# EasyEDA Pro project Edge_Nexus_Main_Shield_Source.epro

# Board newShield_2
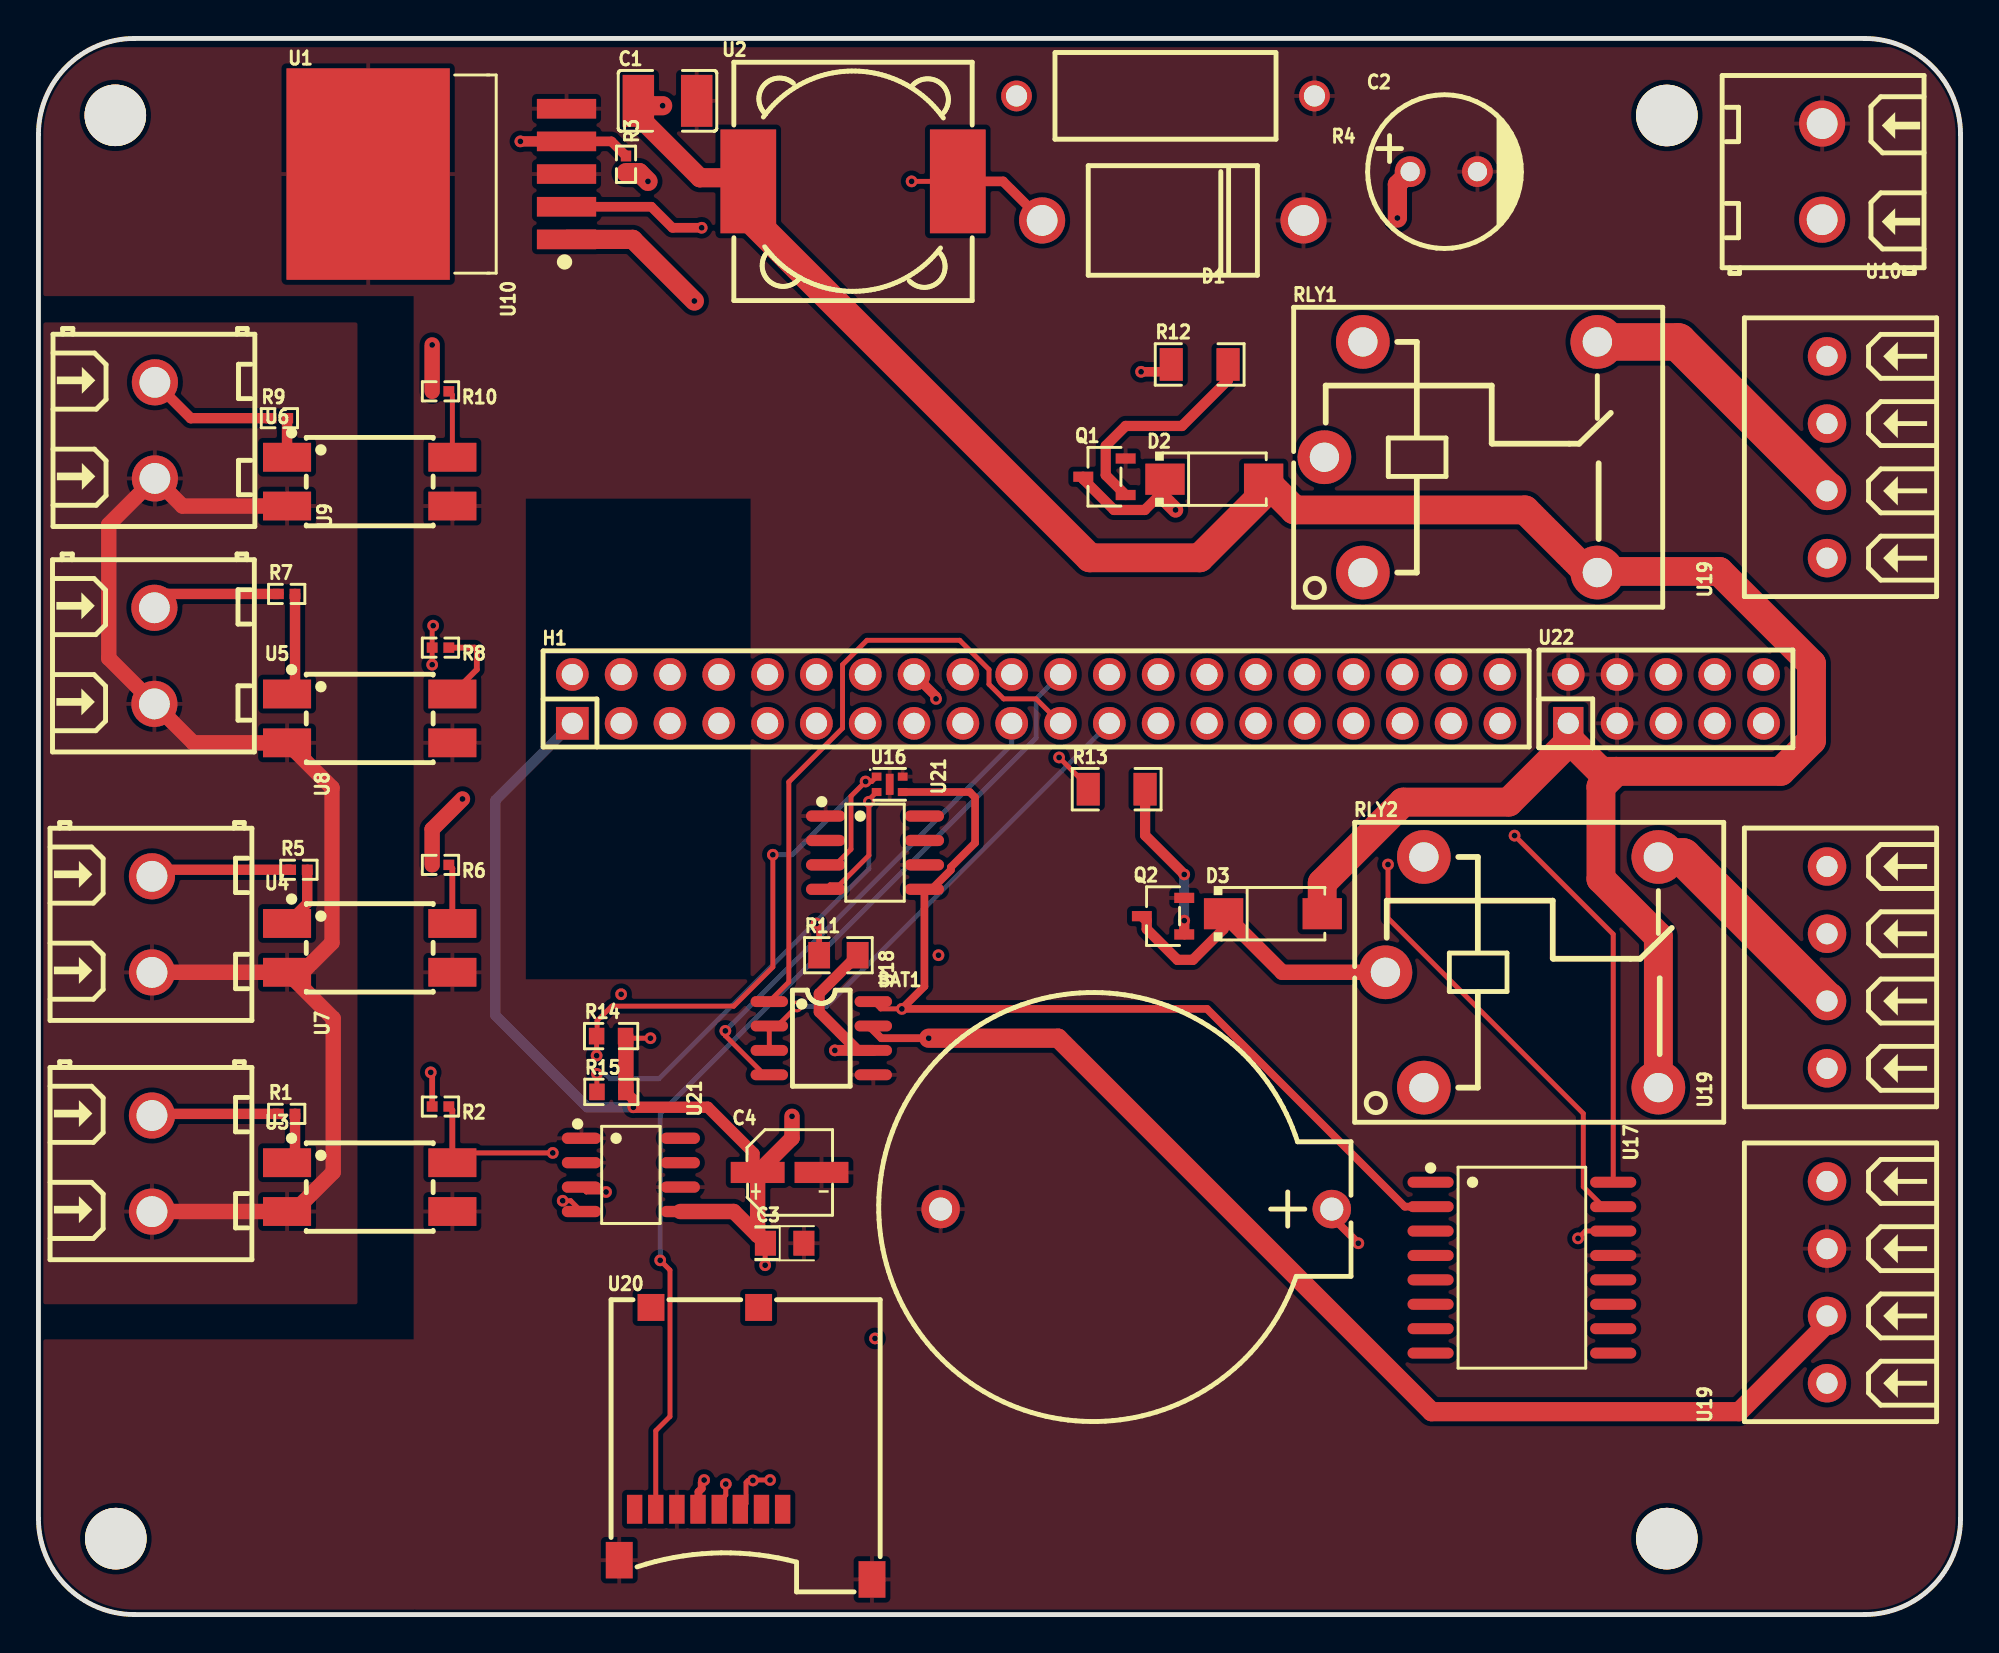
[diagram p0: board, top side]
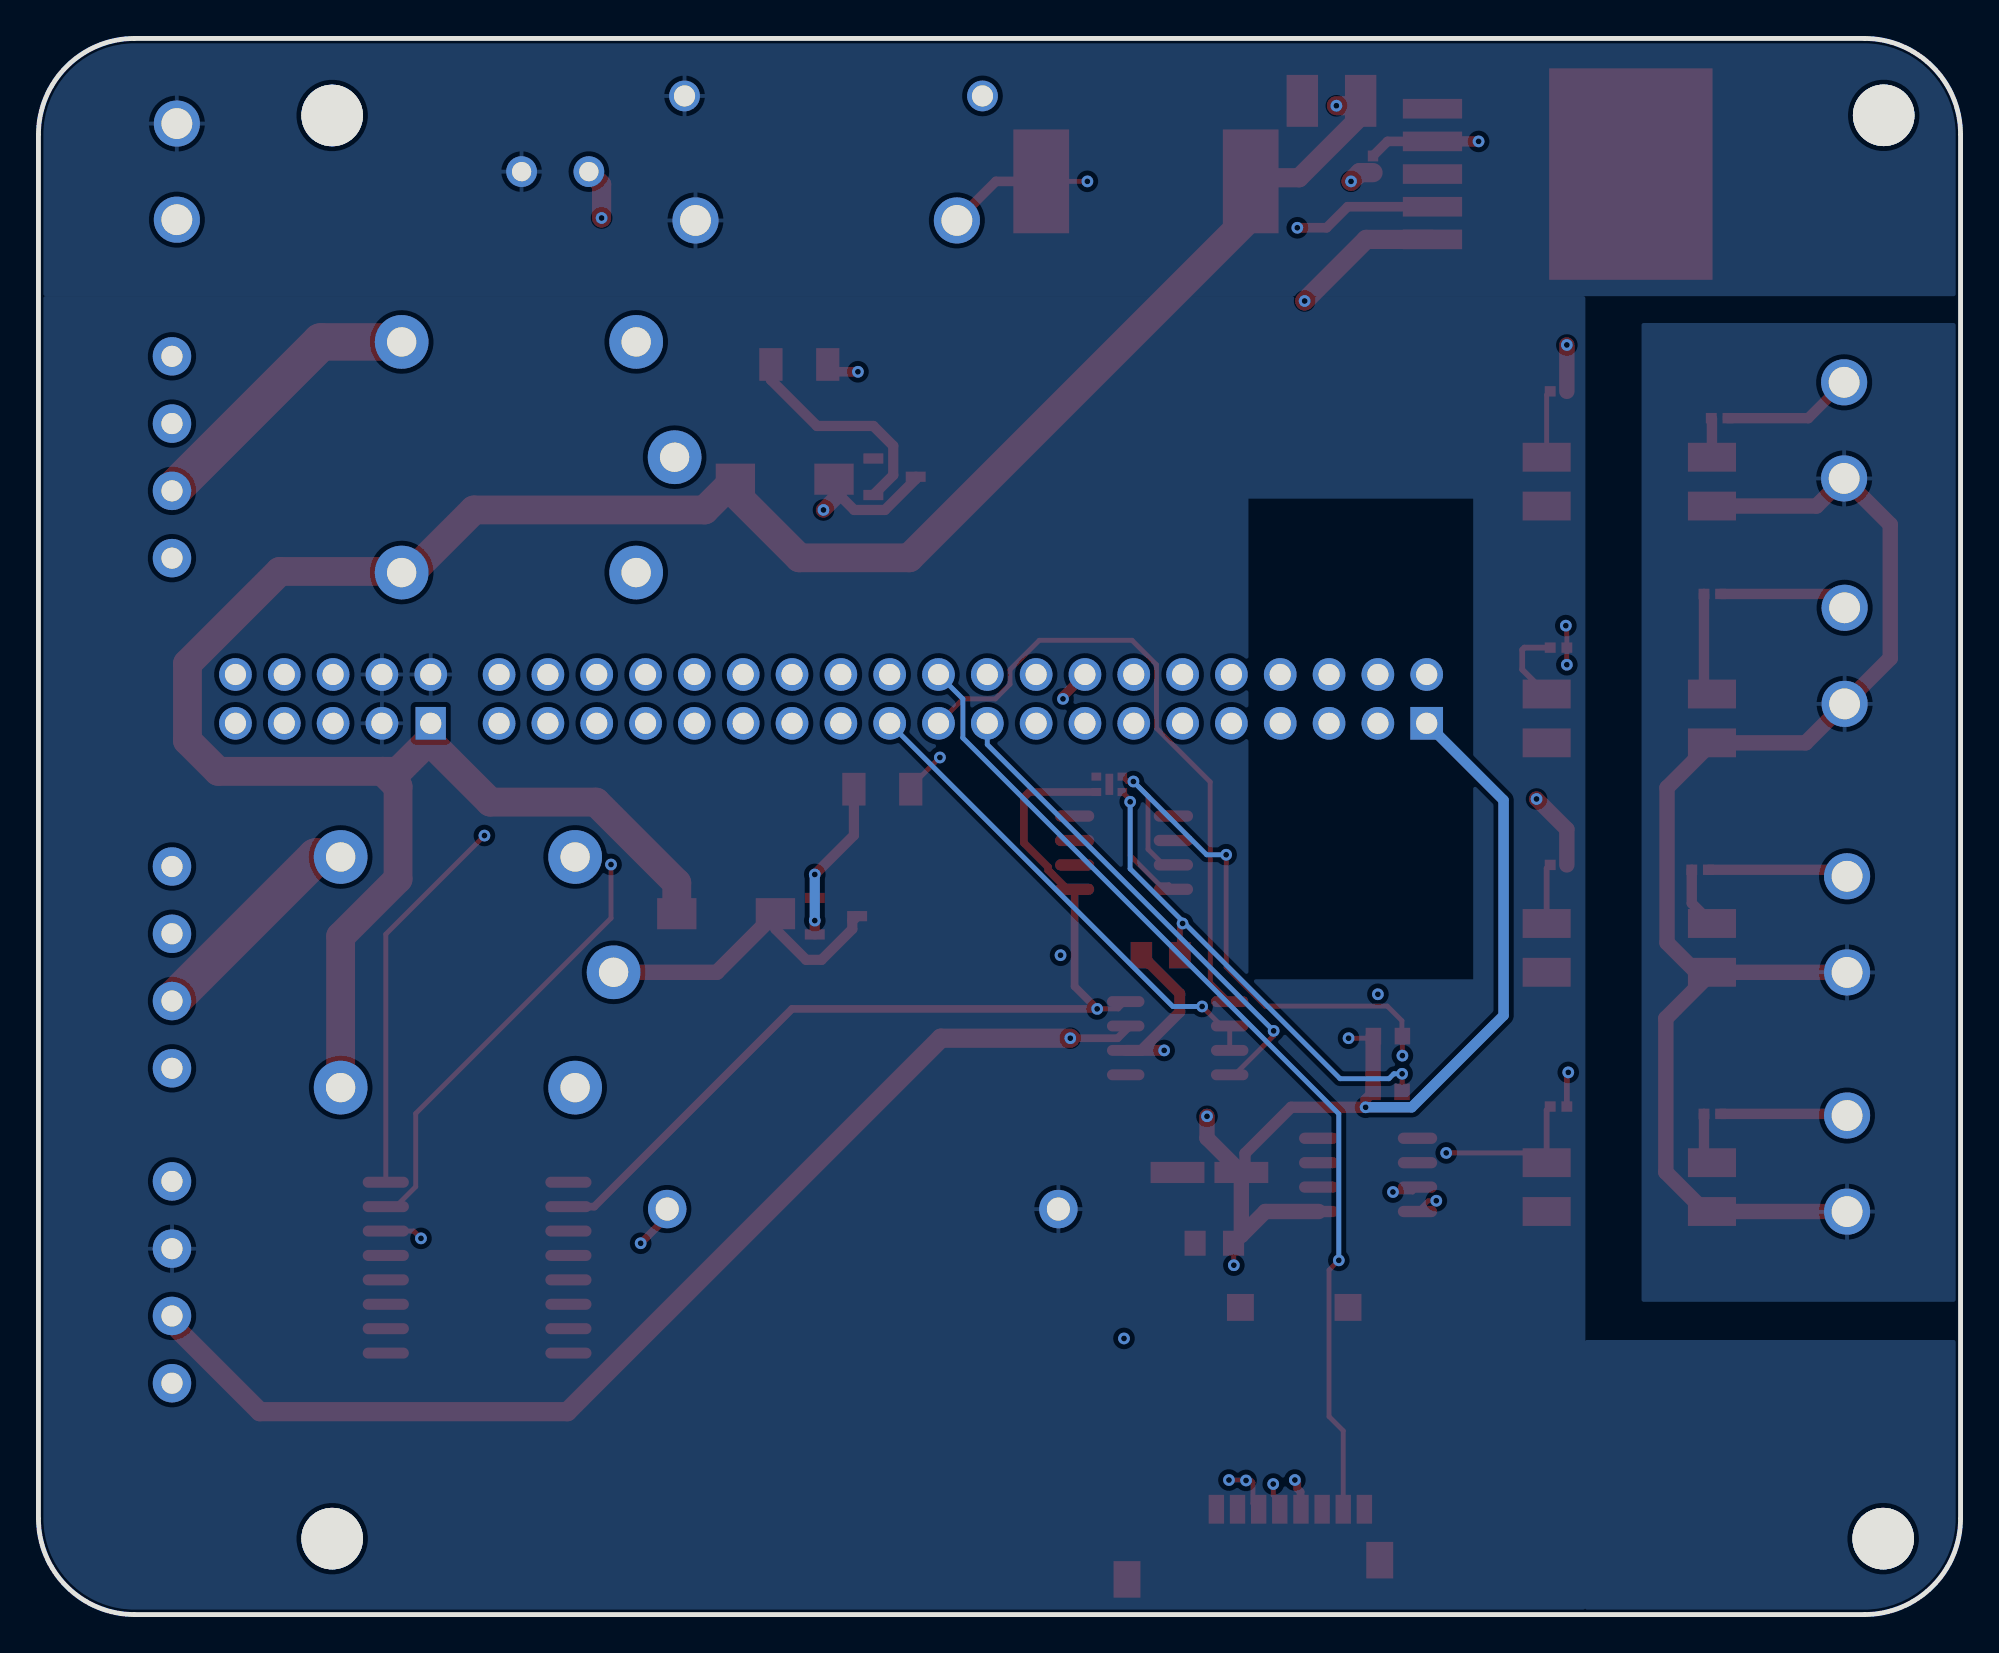
[diagram p1: board, bottom side, seen from below]

Outline 100 x 82 mm; copper layers: Top Layer, Inner1, Inner2, Bottom Layer. Coordinates in mm from the lower left corner of the outline.
Outline path: 0,77 0,5 arc(1.46,1.46) 5,0 95,0 arc(98.54,1.46) 100,5 100,77 arc(98.54,80.54) 95,82 5,82 arc(1.46,80.54) 0,77
Stack: Top Layer 0.035mm Outer layer thickness 1oz / Dielectric1 0.2104mm 7628 RC49% 8.6mil / Inner1 0.0152mm Inner layer thickness / Dielectric2 1.065mm 1.1mm H/HOZ Copper / Inner2 0.0152mm Inner layer thickness / Dielectric3 0.2104mm 7628 RC49% 8.6mil / Bottom Layer 0.035mm Outer layer thickness 1oz

## Design rules (mm)
net 5V_CLEAN: POWER
net GPIO22: SIGNAL
net 3V3_VCC: POWER
net GPIO27: SIGNAL
net GPIO17: SIGNAL
net GPIO4: SIGNAL
net VIN: POWER
net GPIO43: SIGNAL
net RST: SIGNAL
net GPIO44: SIGNAL
net GPIO1: SIGNAL
net GPIO5: SIGNAL
net GPIO2: SIGNAL
net GPIO6: SIGNAL
net GPIO42: SIGNAL
net GPIO7: SIGNAL
net GPIO41: SIGNAL
net RELAY1_CTL: POWER
net RELAY2_CTL: POWER
net GPIO16: SIGNAL
net GPIO39: SIGNAL
net SP3485_TX: SIGNAL
net HMI_LED_DATA: SIGNAL
net SP3485_RX: SIGNAL
net SPI_MISO: SIGNAL
net SP3485_DE_RE: SIGNAL
net SPI_CLK: SIGNAL
net GPIO3: SIGNAL
net SPI_MOSI: SIGNAL
net GPIO46: SIGNAL
net HMI_BTN: SIGNAL
net GPIO9: SIGNAL
net GPIO45: SIGNAL
net GPIO10: SIGNAL
net GPIO48: SIGNAL
net I2C_SDA: SIGNAL
net GPIO47: SIGNAL
net I2C_SCL: SIGNAL
net GPIO21: SIGNAL
net GPIO13: SIGNAL
net GPIO20: SIGNAL
net GPIO14: SIGNAL
net GPIO19: SIGNAL
net VBAT: POWER
net $1N7377: RELAY_HV
net $1N7383: RELAY_HV
net SD_CS: SIGNAL
net COM1: RELAY_HV
net NO1: RELAY_HV
net NC1: RELAY_HV
net NC2: RELAY_HV
net COM2: RELAY_HV
net NO2: RELAY_HV
template: Custom Config
spacing copperThickness1oz (default): track to track 0.102, other pairs 0.152 to 0.3
spacing copperThickness2oz: track to track 0.203, other pairs 0.152 to 0.3
spacing POWER: track to track 0.8, other pairs 0.152 to 0.3
spacing RELAY_HV: track to track 0.152, other pairs 0.152 to 0.3
spacing SIGNAL: track to track 0.152, other pairs 0.152 to 0.3
track width copperThickness1oz: min 0.127, default 0.254, max 2.54
track width copperThickness2oz: min 0.203, default 0.254, max 2.54
track width POWER (default): min 0.127, default 0.254, max 2.54
track width RELAY_HV: min 0.127, default 0.254, max 2.54
track width SIGNAL: min 0.254, default 0.254, max 0.254
differential pair differentialPair (default): width min 0.127, default 0.254, max 2.54; gap min 0.152, default 0.152
via viaSize (default): diameter min 0.5, default 0.61, max 10; hole min 0.3, default 0.305, max 6.3
net class POWER uses POWER
net class SIGNAL uses SIGNAL
net class RELAY_HV uses RELAY_HV
net 5V_CLEAN uses POWER
net GPIO22 uses SIGNAL
net 3V3_VCC uses POWER
net GPIO27 uses SIGNAL
net GPIO17 uses SIGNAL
net GPIO4 uses SIGNAL
net VIN uses POWER
net GPIO43 uses SIGNAL
net RST uses SIGNAL
net GPIO44 uses SIGNAL
net GPIO1 uses SIGNAL
net GPIO5 uses SIGNAL
net GPIO2 uses SIGNAL
net GPIO6 uses SIGNAL
net GPIO42 uses SIGNAL
net GPIO7 uses SIGNAL
net GPIO41 uses SIGNAL
net RELAY1_CTL uses POWER
net RELAY2_CTL uses POWER
net GPIO16 uses SIGNAL
net GPIO39 uses SIGNAL
net SP3485_TX uses SIGNAL
net HMI_LED_DATA uses SIGNAL
net SP3485_RX uses SIGNAL
net SPI_MISO uses SIGNAL
net SP3485_DE_RE uses SIGNAL
net SPI_CLK uses SIGNAL
net GPIO3 uses SIGNAL
net SPI_MOSI uses SIGNAL
net GPIO46 uses SIGNAL
net HMI_BTN uses SIGNAL
net GPIO9 uses SIGNAL
net GPIO45 uses SIGNAL
net GPIO10 uses SIGNAL
net GPIO48 uses SIGNAL
net I2C_SDA uses SIGNAL
net GPIO47 uses SIGNAL
net I2C_SCL uses SIGNAL
net GPIO21 uses SIGNAL
net GPIO13 uses SIGNAL
net GPIO20 uses SIGNAL
net GPIO14 uses SIGNAL
net GPIO19 uses SIGNAL
net VBAT uses POWER
net $1N7377 uses RELAY_HV
net $1N7383 uses RELAY_HV
net SD_CS uses SIGNAL
net COM1 uses RELAY_HV
net NO1 uses RELAY_HV
net NC1 uses RELAY_HV
net NC2 uses RELAY_HV
net COM2 uses RELAY_HV
net NO2 uses RELAY_HV

## Placement (name value [footprint] x y rotation side)
BAT1  CR2032-2-1  [BAT-TH_CR2032-2-1]  57.11 21.1 0 top
C1  220uF  [C1210]  32.73 78.75 0 top
C2  100uF  [CAP-TH_BD8.0-P3.50-D0.6-FD-H10.0]  73.11 75.07 0 top
C3  10uF  [CAP-SMD_L2.0-W1.3-FD]  38.82 19.32 0 top
C4  100nF  [CAP-SMD_BD4.0-L4.3-W4.3-FD]  39.08 23 0 top
D1  1N5822  [DO-201AD_BD5.3-L8.4-P12.50-D1.4-RD]  59.02 72.53 180 top
D2  -  [SMA_L4.4-W2.8-LS5.4-RD]  61.18 59.07 0 top
D3  -  [SMA_L4.4-W2.8-LS5.4-RD]  64.22 36.46 0 top
H1  2.54-2*20P母长PC104  [HDR-TH_40P-P2.54-V-F-R2-C20-S2.54-2]  51.91 47.64 0 top
NOREF  -  [Pad_e554]  4.03 3.95 0 top
NOREF#2  -  [Pad_e557]  84.72 77.99 0 top
NOREF#3  -  [Pad_e555]  4 78 0 top
NOREF#4  -  [Pad_e556]  84.72 3.95 0 top
Q1  S8050 J3Y(RANGE:200-350)  [SOT-23-3_L3.0-W1.7-P0.95-LS2.9-BR]  55.46 59.2 0 top
Q2  S8050 J3Y(RANGE:200-350)  [SOT-23-3_L3.0-W1.7-P0.95-LS2.9-BR]  58.51 36.34 0 top
R1  470Ω  [R0402]  12.92 26.05 0 top
R2  10kΩ  [R0402]  20.92 26.43 180 top
R3  10kΩ  [R0402]  30.57 75.45 270 top
R4  3.3kΩ  [RES-TH_BD4.5-L11.5-P15.50-D0.8]  58.64 79.01 180 top
R5  470Ω  [R0402]  13.55 38.75 0 top
R6  10kΩ  [R0402]  20.92 39 180 top
R7  470Ω  [R0402]  12.92 53.1 0 top
R8  10kΩ  [R0402]  20.92 50.31 180 top
R9  470Ω  [R0402]  12.53 62.24 0 top
R10  10kΩ  [R0402]  20.92 63.64 180 top
R11  120Ω  [R0805]  41.62 34.3 0 top
R12  1kΩ  [R1206]  60.41 65.04 0 top
R13  1kΩ  [R1206]  56.1 42.94 0 top
R14  4.7kΩ  [R0603]  29.79 30.1 0 top
R15  4.7kΩ  [R0603]  29.81 27.19 0 top
RLY1  SRD-05VDC-SL-C  [RELAY-TH_SRD-XXVDC-XL-C]  74 60.21 0 top
RLY2  SRD-05VDC-SL-C  [RELAY-TH_SRD-XXVDC-XL-C]  77.18 33.42 0 top
U1  LM2596S-ADJ(UMW)  [TO-263-5_L10.2-W8.9-P1.70-BR]  22.31 74.94 0 top
U2  100uH  [IND-SMD_L12.3-W12.3]  42.38 74.56 0 top
U3  PC817C  [OPTO-SMD-4_L4.6-W6.5-P2.54-LS10.3-TL]  17.23 22.24 0 top
U4  PC817C  [OPTO-SMD-4_L4.6-W6.5-P2.54-LS10.3-TL]  17.23 34.69 0 top
U5  PC817C  [OPTO-SMD-4_L4.6-W6.5-P2.54-LS10.3-TL]  17.23 46.62 0 top
U6  PC817C  [OPTO-SMD-4_L4.6-W6.5-P2.54-LS10.3-TL]  17.23 58.94 0 top
U7  KF128-5.0-2P  [CONN-TH_P5.00_KF128-5.0-2P]  5.91 23.46 270 top
U8  KF128-5.0-2P  [CONN-TH_P5.00_KF128-5.0-2P]  5.91 35.91 270 top
U9  KF128-5.0-2P  [CONN-TH_P5.00_KF128-5.0-2P]  6.03 49.88 270 top
U10  -  [CONN-TH_P5.00_KF128-5.0-2P]  92.8 75.07 90 top
U10#2  -  [CONN-TH_P5.00_KF128-5.0-2P]  6.06 61.61 270 top
U16  SHT41A-BD1B-R2  [DFN-4_L1.5-W1.5-P0.80-TL-EP]  44.29 43.19 0 top
U17  DS3231SN#  [SOIC-16_L10.3-W7.5-P1.27-LS10.3-BL]  77.18 18.05 270 top
U18  SP3485EN-L/TR  [SOIC-8_L5.0-W4.0-P1.27-LS6.0-BL]  40.73 29.99 270 top
U19  -  [CONN-TH_4P-P3.50_MX127S-3.5-04P-GN01-CU-Y-A]  93.05 17.29 90 top
U19#2  -  [CONN-TH_4P-P3.50_MX127S-3.5-04P-GN01-CU-Y-A]  93.05 60.21 90 top
U19#3  -  [CONN-TH_4P-P3.50_MX127S-3.5-04P-GN01-CU-Y-A]  93.05 33.67 90 top
U20  M6027-01  [TF-SMD_M6027-01]  36.79 8.9 0 top
U21  -  [SOIC-8_L4.9-W3.9-P1.27-LS6.0-BL]  43.52 39.64 270 top
U21#2  -  [SOIC-8_L4.9-W3.9-P1.27-LS6.0-BL]  30.82 22.87 270 top
U22  2.54-2*5  [HDR-TH_10P-P2.54-V-F-R2-C5-S2.54]  84.67 47.64 0 top

## Footprints (pads in the part's own frame, mm; a bottom-side part is the same pattern mirrored in y, then rotated)
BAT-TH_CR2032-2-1
  round 2 hole 1.2: 1(10.175,0) 2(-10.175,0)
C1210
  rect 1.635x2.7 smd: 1(-1.518,0) 2(1.518,0)
CAP-SMD_BD4.0-L4.3-W4.3-FD
  rect 2.8x1.1 smd: 1(-1.661,0) 2(1.661,0)
CAP-SMD_L2.0-W1.3-FD
  rect 1.1x1.3 smd: 1(-1,0) 2(1,0)
CAP-TH_BD8.0-P3.50-D0.6-FD-H10.0
  round 1.6 hole 1: 1(-1.75,0) 2(1.75,0)
CONN-TH_4P-P3.50_MX127S-3.5-04P-GN01-CU-Y-A
  round 2 hole 1.1: 1(-5.25,0) 2(-1.75,0) 3(1.75,0) 4(5.25,0)
CONN-TH_P5.00_KF128-5.0-2P
  round 2.4 hole 1.6: 1(-2.5,0) 2(2.5,0)
DFN-4_L1.5-W1.5-P0.80-TL-EP
  rect 0.505x0.42 smd: 1(-0.677,0.4) 2(-0.677,-0.4) 3(0.677,-0.4) 4(0.677,0.4)
  rect 0.4x1.1 smd: 5(0,0)
DO-201AD_BD5.3-L8.4-P12.50-D1.4-RD
  round 2.4 hole 1.6: 1(-6.8,0) 2(6.8,0)
HDR-TH_10P-P2.54-V-F-R2-C5-S2.54
  rect 1.575x1.7 hole 1.1: 1(-5.08,-1.27)
  round 1.7 hole 1.1: 2(-5.08,1.27) 3(-2.54,-1.27) 4(-2.54,1.27) 5(0,-1.27) 6(0,1.27) 7(2.54,-1.27) 8(2.54,1.27) 9(5.08,-1.27) 10(5.08,1.27)
HDR-TH_40P-P2.54-V-F-R2-C20-S2.54-2
  rect 1.7x1.7 hole 1.1: 1(-24.13,-1.27)
  round 1.7 hole 1.1: 2(-24.13,1.27) 3(-21.59,-1.27) 4(-21.59,1.27) 5(-19.05,-1.27) 6(-19.05,1.27) 7(-16.51,-1.27) 8(-16.51,1.27) 9(-13.97,-1.27) 10(-13.97,1.27) 11(-11.43,-1.27) 12(-11.43,1.27) 13(-8.89,-1.27) 14(-8.89,1.27) 15(-6.35,-1.27) 16(-6.35,1.27) 17(-3.81,-1.27) 18(-3.81,1.27) 19(-1.27,-1.27) 20(-1.27,1.27) 21(1.27,-1.27) 22(1.27,1.27) 23(3.81,-1.27) 24(3.81,1.27) 25(6.35,-1.27) 26(6.35,1.27) 27(8.89,-1.27) 28(8.89,1.27) 29(11.43,-1.27) 30(11.43,1.27) 31(13.97,-1.27) 32(13.97,1.27) 33(16.51,-1.27) 34(16.51,1.27) 35(19.05,-1.27) 36(19.05,1.27) 37(21.59,-1.27) 38(21.59,1.27) 39(24.13,-1.27) 40(24.13,1.27)
IND-SMD_L12.3-W12.3
  rect 2.9x5.4 smd: 1(-5.45,0) 2(5.45,0)
OPTO-SMD-4_L4.6-W6.5-P2.54-LS10.3-TL
  rect 2.5x1.5 smd: 1(-4.3,1.27) 2(-4.3,-1.27) 3(4.3,-1.27) 4(4.3,1.27)
Pad_e554
  round 3.2 hole 3.2: 1(0,0)
Pad_e555
  round 3.2 hole 3.2: 1(0,0)
Pad_e556
  round 3.2 hole 3.2: 1(0,0)
Pad_e557
  round 3.2 hole 3.2: 1(0,0)
R0402
  rect 0.566x0.54 smd: 1(-0.433,0) 2(0.433,0)
R0603
  rect 0.806x0.864 smd: 1(-0.753,0) 2(0.753,0)
R0805
  rect 1.133x1.377 smd: 1(-1,0) 2(1,0)
R1206
  rect 1.208x1.701 smd: 1(-1.479,0) 2(1.479,0)
RELAY-TH_SRD-XXVDC-XL-C
  round 2.794 hole 1.524: 1(-5.1,-6) 2(7.1,-6) 3(7.1,6) 4(-5.1,6) 5(-7.1,0)
RES-TH_BD4.5-L11.5-P15.50-D0.8
  round 1.6 hole 1.1: 1(-7.75,0) 2(7.75,0)
SMA_L4.4-W2.8-LS5.4-RD
  rect 2.046x1.62 smd: 1(-2.566,0) 2(2.566,0)
SOIC-8_L4.9-W3.9-P1.27-LS6.0-BL
  oval 0.588x2.045 smd: 1(-1.905,-2.57) 2(-0.635,-2.57) 3(0.635,-2.57) 4(1.905,-2.57) 5(1.905,2.57) 6(0.635,2.57) 7(-0.635,2.57) 8(-1.905,2.57)
SOIC-8_L5.0-W4.0-P1.27-LS6.0-BL
  oval 0.569x1.95 smd: 1(-1.905,-2.705) 2(-0.635,-2.705) 3(0.635,-2.705) 4(1.905,-2.705) 5(1.905,2.705) 6(0.635,2.705) 7(-0.635,2.705) 8(-1.905,2.705)
SOIC-16_L10.3-W7.5-P1.27-LS10.3-BL
  oval 0.574x2.401 smd: 1(-4.445,-4.75) 2(-3.175,-4.75) 3(-1.905,-4.75) 4(-0.635,-4.75) 5(0.635,-4.75) 6(1.905,-4.75) 7(3.175,-4.75) 8(4.445,-4.75) 9(4.445,4.75) 10(3.175,4.75) 11(1.905,4.75) 12(0.635,4.75) 13(-0.635,4.75) 14(-1.905,4.75) 15(-3.175,4.75) 16(-4.445,4.75)
SOT-23-3_L3.0-W1.7-P0.95-LS2.9-BR
  rect 1.038x0.532 smd: 1(1.101,-0.95) 2(1.101,0.95) 3(-1.101,0)
TF-SMD_M6027-01
  rect 0.8x1.5 smd: 1(1.925,-3.425) 2(0.825,-3.425) 3(-0.275,-3.425) 4(-1.375,-3.425) 5(-2.475,-3.425) 6(-3.575,-3.425) 7(-4.675,-3.425) 8(-5.775,-3.425)
  rect 1.4x1.4 smd: 9(-4.925,7.075) 10(0.675,7.075)
  rect 1.4x1.9 smd: 11(6.575,-7.075) 12(-6.575,-6.075)
TO-263-5_L10.2-W8.9-P1.70-BR
  rect 3.083x1.02 smd: 1(5.16,-3.4) 2(5.16,-1.7) 3(5.16,0) 4(5.16,1.7) 5(5.16,3.4)
  rect 8.5x11 smd: 6(-5.16,0)

## Nets
3V3_VCC: C3.1 C4.1 H1.1 H1.3 R2.2 R6.2 R8.2 R10.2 R14.2 R15.2 U16.3 U17.2 U18.8 U20.4 U21.5 U21#2.5
5V_CLEAN: C1.1 D2.2 D3.2 R3.2 RLY1.2 RLY2.2 U2.1 U22.1
GND_CLEAN: BAT1.2 C1.2 C2.2 C3.2 C4.2 D1.1 H1.2 Q1.2 Q2.2 R4.1 U1.3 U1.5 U1.6 U3.3 U4.3 U5.3 U6.3 U10.2 U16.4 U16.5 U17.13 U18.5 U19.3 U20.6 U20.11 U20.12 U21.1 U21.2 U21.6 U21#2.1 U21#2.2 U21#2.6 U22.2 U22.3 U22.4
GND_DIRTY: U3.2 U4.2 U5.2 U6.2 U7.2 U8.2 U9.2 U10#2.2
VBAT: BAT1.1 U17.14
VIN: C2.1 U1.1 U10.1
COM1: RLY1.1 U19#2.1
COM2: RLY2.1 U19#3.1
GPIO1: H1.8
GPIO2: H1.10
GPIO3: H1.25
GPIO4: H1.7 R2.1 U3.4
GPIO5: H1.9
GPIO6: H1.11
GPIO7: H1.13
GPIO9: H1.29
GPIO10: H1.31
GPIO13: H1.37
GPIO14: H1.39
GPIO16: H1.17
GPIO17: R6.1 U4.4
GPIO19: H1.40
GPIO20: H1.38
GPIO21: H1.36
GPIO22: R10.1 U6.4
GPIO27: R8.1 U5.4
GPIO39: H1.18
GPIO41: H1.14
GPIO42: H1.12
GPIO43: H1.4
GPIO44: H1.6
GPIO45: H1.30
GPIO46: H1.27
GPIO47: H1.34
GPIO48: H1.32
HMI_BTN: H1.28
HMI_LED_DATA: H1.20
I2C_SCL: H1.35 R15.1 U16.2 U17.16 U21.4 U21#2.4
I2C_SDA: H1.33 R14.1 U16.1 U17.15 U21.3 U21#2.3
NC1: RLY1.4 U19#2.3
NC2: RLY2.4 U19#3.3
NO1: RLY1.3 U19#2.2
NO2: RLY2.3 U19#3.2
RELAY1_CTL: H1.15 R12.1
RELAY2_CTL: H1.16 R13.1
RST: H1.5
SD_CS: U20.2
SP3485_DE_RE: H1.23 U18.2 U18.3
SP3485_RX: H1.21 U18.1
SP3485_TX: H1.19 U18.4
SPI_CLK: H1.24 U20.5
SPI_MISO: H1.22 U20.7
SPI_MOSI: H1.26 U20.3
$1N293: R1.2 U3.1
$1N340: R1.1 U7.1
$1N1294: D1.2 U1.2 U2.2
$1N1349: R3.1 R4.2 U1.4
$1N1584: R5.2 U4.1
$1N1588: R5.1 U8.1
$1N1965: R7.2 U5.1
$1N1967: R7.1 U9.1
$1N2149: R9.2 U6.1
$1N2151: R9.1 U10#2.1
$1N7377: R11.2 U18.6 U19.1
$1N7383: R11.1 U18.7 U19.2
$1N8189: Q1.1 R12.2
$1N8338: Q2.1 R13.2
$1N8343: D3.1 Q2.3 RLY2.5
$1N8542: D2.1 Q1.3 RLY1.5

Pads without a net: NOREF 1; NOREF#2 1; NOREF#3 1; NOREF#4 1; U17 1 3 4 5 6 7 8 9 10 11 12; U19 4; U19#2 4; U19#3 4; U20 1 8 9 10; U21 7 8; U21#2 7 8; U22 5 6 7 8 9 10

## Via types
v1: diameter 0.61, hole 0.305, Top Layer to Bottom Layer, 48 vias

## Routing (per net, layer and track width the routed paths; a pad name or vN(x,y) marks a point on that pad's centre or on a via; arc(x,y) is an arc through that point)
3V3_VCC: length 189.2
  Top Layer w0.254: v1(35.76,6.79) 35.76,6.21 35.46,5.92 35.46,5.53 U20.4 ; v1(31.84,29.99) 30.66,29.99 R14.2 ; v1(20.54,51.45) 20.48,51.4 v1(20.48,49.42) ; U18.8 43.82,31.51 v1(44.92,31.51) ; C3.1 37.81,19.3 37.81,18.43
  Top Layer w0.3: v1(20.41,28.21) 20.48,28.13 20.48,26.43
  Top Layer w0.4: U16.3 48.45,42.79 48.73,42.51 48.73,40.15 47.47,38.88 47.47,38.74 46.47,37.73 U21.5 46.09,32.68 v1(44.92,31.51) 60.8,31.51 71.08,21.22 U17.2
  Top Layer w0.54: R15.2 30.95,26.8 v1(30.95,26.39)
  Top Layer w0.588: v1(30.95,26.39) 34.83,26.39 37.23,23.99 37.23,23.19 C4.1
  Top Layer w0.8: U21#2.5 36.17,20.97 37.42,19.72 C4.1 39.2,24.79 v1(39.2,25.92) ; 30.56,30.08 R15.2 ; 20.48,63.64 v1(20.48,66.05) ; v1(22.06,42.43) 20.48,40.86 20.48,39
  Inner1 w0.254: v1(20.54,51.45) 20.48,51.5 v1(20.48,66.05) ; v1(43.52,14.37) 41.62,14.37 v1(37.81,18.17)
  Inner1 w0.8: v1(20.48,49.42) 24.04,45.86 27.27,45.86 H1.1 ; v1(20.41,28.21) 26.25,28.21 v1(30.32,32.27) 31.84,30.75 v1(31.84,29.99)
  Inner2 w0.254: v1(43.52,14.37) 43.49,14.37 35.84,6.71
  Inner2 w0.8: v1(39.2,25.92) 41.36,25.92 44.92,29.48 v1(44.92,31.51) ; H1.3 H1.1 23.84,42.43 v1(22.06,42.43)
  Bottom Layer w0.54: H1.1 23.78,42.37 23.78,31.17 28.55,26.39 v1(30.95,26.39)
5V_CLEAN: length 140.6
  Top Layer w0.8: U22.1 79.69,46.27 79.69,45.47 ; 81.05,54.27 RLY1.2
  Top Layer w1: R3.2 31.26,75.02 v1(31.71,74.56) ; v1(32.47,78.5) 31.46,78.5 C1.1 31.21,77.95 34.41,74.75 36.74,74.75 36.93,74.56
  Top Layer w1.5: 82.09,43.87 81.29,43.07 81.29,38.27 84.28,35.28 RLY2.2 ; 82.09,43.87 81.29,43.87 79.69,45.47 76.49,42.27 71,42.27 66.79,38.06 D3.2 ; 82.09,43.87 90.65,43.87 92.25,45.47 92.25,49.47 87.45,54.27 80.54,54.27 77.34,57.47 65.34,57.47 D2.2 63.74,58.31 60.41,54.98 54.7,54.98 36.8,72.87 36.8,74.44 36.93,74.56
  Inner1 w0.5: v1(32.47,78.5) 31.08,77.1 31.08,75.2 v1(31.71,74.56)
GND_DIRTY: length 72
  Top Layer w0.8: 12.93,33.42 13.73,33.42 15.27,34.95 15.27,43.02 12.93,45.35 8.06,45.35 U9.2 3.66,49.75 3.66,56.71 U10#2.2 7.5,57.67 12.93,57.67 ; 12.93,33.42 5.91,33.42 ; 12.93,33.42 15.33,31.02 15.33,23.02 13.29,20.97 5.91,20.97
VBAT: length 15.9
  Top Layer w0.254: U17.14 80.48,19.95 v1(80.1,19.57)
  Top Layer w0.4: v1(68.67,19.32) 67.29,20.7 BAT1.1
  Inner1 w0.254: v1(80.1,19.57) 79.85,19.32 v1(68.67,19.32)
VIN: length 71.5
  Top Layer w1: v1(34.13,68.34) 30.92,71.54 U1.1 ; v1(70.7,72.66) 70.7,74.41 C2.1
  Inner1 w1: v1(70.7,72.66) 66.38,68.34 v1(34.13,68.34)
  Inner2 w1: U10.1 73.86,72.57 C2.1
COM1: length 27.2
  Inner2 w1.95: RLY1.1 72.9,58.21 89.8,58.21 U19#2.1
COM2: length 23.9
  Inner1 w1.95: RLY2.1 76.08,31.42 90.06,31.42 U19#3.1
GPIO4: length 37.1
  Top Layer w0.254: v1(26.76,24.02) 22.04,24.02 U3.4
  Top Layer w0.3: U3.4 21.53,26.25 R2.1
  Inner2 w0.254: v1(26.76,24.02) 30.57,27.83 32.35,27.83 37.43,32.91 37.43,44.34 H1.7
GPIO17: length 3.1
  Top Layer w0.3: U4.4 21.53,38.82 R6.1
GPIO22: length 3.5
  Top Layer w0.254: R10.1 21.53,63.46 U6.4
GPIO27: length 4.3
  Top Layer w0.3: U5.4 22.81,49.17 22.81,50.19 22.7,50.31 R8.1
I2C_SCL: length 99.7
  Top Layer w0.254: v1(29.05,28.13) R15.1 ; v1(76.8,40.53) 81.93,35.4 U17.16 ; U21#2.4 27.69,21.53 v1(27.28,21.53) ; U21.4 41.19,37.97 41.68,37.97 43.2,39.49 v1(43.2,42.29) 43.2,42.39 U16.2
  Inner1 w0.254: v1(27.28,21.53) 29.05,23.31 v1(29.05,28.13) ; v1(76.8,40.53) H1.35 69.69,47.64 50.13,47.64 49.36,46.88 49.36,45.86 47.67,44.17 42.85,44.17 42.34,43.66 42.34,43.15 v1(43.2,42.29)
  Bottom Layer w0.254: v1(43.2,42.29) 43.2,38.8 32.28,27.88 29.74,27.88 29.49,28.13 v1(29.05,28.13)
I2C_SDA: length 95.5
  Top Layer w0.254: v1(38.21,39.53) 38.21,33.69 36.18,31.66 29.83,31.66 29.06,30.89 29.06,30.12 R14.1 v1(29.04,29.08) ; U21.3 41.46,39 42.27,39.81 42.27,42.58 v1(43.03,43.34) 43.35,43.34 U16.1 ; v1(29.53,21.98) 28.51,21.98 U21#2.3 ; v1(70.21,39.02) 70.21,36.23 80.37,26.07 80.37,22.26 81.39,21.24 81.91,21.24 U17.15
  Inner1 w0.254: 65.64,43.59 43.29,43.59 v1(43.03,43.34) ; 65.64,43.59 H1.33 ; 65.64,43.59 v1(70.21,39.02) ; v1(29.53,21.98) 29.53,27.54 29.8,27.81 29.8,28.32 v1(29.04,29.08)
  Bottom Layer w0.254: v1(38.21,39.53) 39.22,39.53 v1(43.03,43.34)
NC1: length 25.9
  Inner2 w1.95: RLY1.4 73.15,61.96 U19#2.3
NC2: length 22.6
  Inner2 w1.95: RLY2.4 76.07,35.42 U19#3.3
NO1: length 15.2
  Top Layer w1.95: RLY1.3 85.3,66.21 U19#2.2
NO2: length 11.9
  Top Layer w1.95: RLY2.3 85.56,39.41 U19#3.2
RELAY1_CTL: length 26.6
  Top Layer w0.5: R12.1 58.55,64.66 v1(57.37,64.66)
  Inner1 w0.5: H1.15 45.55,46.5 44.29,47.77 44.29,52.72 56.22,64.66 v1(57.37,64.66)
RELAY2_CTL: length 14.9
  Top Layer w0.254: v1(53.1,44.59) 54.62,43.07 R13.1
  Top Layer w0.5: v1(46.7,47.64) 46.7,47.77 H1.16
  Inner2 w0.254: v1(46.7,47.64) 46.84,47.5 48.56,47.5 49.22,46.84 49.22,45.11 51.4,42.94 52.92,42.94 53.1,43.12 v1(53.1,44.59)
SP3485_DE_RE: length 25.5
  Top Layer w0.254: 38.02,29.35 38.02,30.62 38.44,30.62 v1(39.46,31.64)
  Bottom Layer w0.254: v1(39.46,31.64) 40.98,31.64 H1.23
SP3485_RX: length 33.2
  Top Layer w0.254: 38.02,31.89 39.04,32.91 39.04,43.32 41.83,46.12 41.83,49.42 43.1,50.69 47.93,50.69 49.45,49.16 49.45,48.4 50.22,47.64 51.91,47.64 H1.21
SP3485_TX: length 25.6
  Top Layer w0.254: 38.02,28.08 37.77,28.08 35.74,30.11 v1(35.74,30.37)
  Bottom Layer w0.254: v1(35.74,30.37) 50.64,45.26 H1.19
SPI_CLK: length 52.8
  Top Layer w0.4: 34.29,5.48 34.29,5.95 34.34,5.99 34.34,6.38 34.51,6.55 34.51,6.87 v1(34.63,7)
  Inner2 w0.254: H1.24 54.95,48.91 54.45,48.4 54.45,26.81 48.22,20.58 48.22,20.57 47.47,19.82 47.45,19.82 v1(34.63,7)
SPI_MISO: length 52.6
  Top Layer w0.254: v1(32.35,18.43) 32.86,17.92 32.86,10.3 32.12,9.56 U20.7
  Bottom Layer w0.254: H1.22 51.91,47.64 51.91,45.61 32.35,26.05 v1(32.35,18.43)
SPI_MOSI: length 56.8
  Top Layer w0.254: v1(38.06,7) 37.2,7 v1(37.17,6.98) 36.92,6.98 36.81,6.87 36.81,5.78 U20.3
  Inner2 w0.254: H1.26 59.52,47.64 59.52,47.51 59.4,47.39 59.4,46.93 59.35,46.88 59.38,46.84 59.38,45.21 59.35,45.17 59.35,44.77 59.52,44.59 60.29,44.59 61.94,42.94 61.94,33.73 48.62,20.41 48.62,17.97 38.06,7.41 v1(38.06,7)
$1N293: length 2.7
  Top Layer w0.54: 12.93,23.51 13.35,23.92 R1.2
$1N340: length 6.6
  Top Layer w0.54: U7.1 5.99,26.05 R1.1
$1N1294: length 27
  Top Layer w0.254: v1(45.43,74.56) U2.2
  Top Layer w0.5: U1.2 31.89,73.24 32.98,72.15 v1(34.51,72.15) ; D1.2 50.19,74.56 U2.2
  Inner1 w0.254: v1(34.51,72.15) 43.02,72.15 v1(45.43,74.56)
$1N1349: length 32.6
  Top Layer w0.5: U1.4 29.81,76.64 R3.1
  Top Layer w0.54: U1.4 v1(25.07,76.64)
  Inner2 w0.54: v1(25.07,76.64) 48.52,76.64 R4.2
$1N1584: length 3.2
  Top Layer w0.54: 12.93,35.95 13.98,37 R5.2
$1N1588: length 7.4
  Top Layer w0.54: R5.1 6.25,38.75 U8.1
$1N1965: length 5.4
  Top Layer w0.54: 12.93,47.89 13.35,48.31 R7.2
$1N1967: length 6.7
  Top Layer w0.54: R7.1 6.75,53.1 U9.1
$1N2149: length 2
  Top Layer w0.54: 12.93,60.21 12.93,62.21 R9.2
$1N2151: length 6.8
  Top Layer w0.54: U10#2.1 7.92,62.24 R9.1
$1N7377: length 67
  Top Layer w0.569: R11.2 40.62,32.3 40.62,31.35 42.62,29.35 ; 42.62,29.35 U18.6 ; 42.62,29.35 v1(41.43,29.35)
  Inner1 w1.5: U19.1 92.55,12.54 59.51,12.54 42.7,29.35 41.84,29.35
$1N7383: length 73.6
  Top Layer w0.3: v1(40.48,35.95) 40.62,35.81 R11.1
  Top Layer w0.4: 43.32,30.51 43.85,29.99 v1(46.32,29.99)
  Top Layer w1: U19.2 93.05,15.13 88.48,10.56 72.48,10.56 53.05,29.99 v1(46.32,29.99)
  Inner1 w0.3: v1(46.32,29.99) 46.83,30.49 v1(46.83,34.3)
  Inner2 w0.3: v1(46.83,34.3) 45.17,35.95 v1(40.48,35.95)
$1N8189: length 11.6
  Top Layer w0.532: R12.2 61.89,64.24 59.49,61.84 56.56,61.84 55.53,60.8 55.53,59.28 Q1.1
$1N8338: length 8.4
  Top Layer w0.532: v1(59.61,38.5) 57.58,40.54 R13.2 ; v1(59.61,36.1) Q2.1
  Bottom Layer w0.532: v1(59.61,38.5) v1(59.61,36.1)
$1N8343: length 16.6
  Top Layer w0.532: Q2.3 57.66,36.09 57.66,35.66 59.26,34.06 60.06,34.06 61.66,35.66 D3.1
  Top Layer w0.8: D3.1 64.71,33.42 RLY2.5
$1N8542: length 16
  Top Layer w0.532: Q1.3 54.36,59.07 55.96,57.47 57.56,57.47 58.36,58.27 58.36,58.82 D2.1
  Top Layer w0.8: 58.36,58.27 v1(59.16,57.47)
  Inner1 w0.8: RLY1.5 64.16,57.47 v1(59.16,57.47)

## Copper pours and planes (outline as drawn; the poured copper is in the pictures)
GND_CLEAN on Top Layer: -0.29,81.55 99.91,81.55 99.91,68.59 -0.29,68.59
GND_CLEAN on Top Layer: 19.52,68.72 100,68.72 100,0.14 19.52,0.14
GND_CLEAN on Top Layer: 0,14.32 19.62,14.32 19.62,0 0,0
GND_CLEAN on Bottom Layer: -0.07,14.29 19.55,14.29 19.55,-0.03 -0.07,-0.03
GND_CLEAN on Bottom Layer: 19.52,68.59 100,68.59 100,0.22 19.52,0.22
GND_CLEAN on Bottom Layer: -0.55,81.93 100.17,81.93 100.17,68.59 -0.55,68.59
GND_CLEAN on Inner1: 0,13.89 19.95,13.89 19.95,0 0,0
GND_CLEAN on Inner1: -0.42,81.8 100,81.8 100,68.59 -0.42,68.59
GND_CLEAN on Inner1: 0,14.21 19.52,14.21 19.52,0.22 0,0.22
GND_CLEAN on Inner1: 19.77,68.85 99.78,68.85 99.78,-0.75 19.77,-0.75
GND_CLEAN on Inner2: -0.55,81.93 19.65,81.93 19.65,68.59 -0.55,68.59
GND_CLEAN on Inner2: -0.29,14.11 19.52,14.11 19.52,0.14 -0.29,0.14
GND_CLEAN on Inner2: 0,14.33 19.68,14.33 19.68,0.14 0,0.14
GND_CLEAN on Inner2: 19.65,81.93 100.29,81.93 100.29,-0.11 19.65,-0.11
GND_CLEAN on Inner2: -0.29,81.96 19.27,81.96 19.27,68.85 -0.29,68.85
GND_DIRTY on Top Layer: 0,67.23 16.6,67.23 16.6,16.14 0,16.14
GND_DIRTY on Bottom Layer: -0.16,67.2 16.6,67.2 16.6,16.27 -0.16,16.27
GND_DIRTY on Inner1: 0,67.15 16.22,67.15 16.22,16.27 0,16.27
GND_DIRTY on Inner2: 0,67.02 16.73,67.02 16.73,16.32 0,16.32
